# EAGLE design buckconverter (EAGLE 9.6.2)
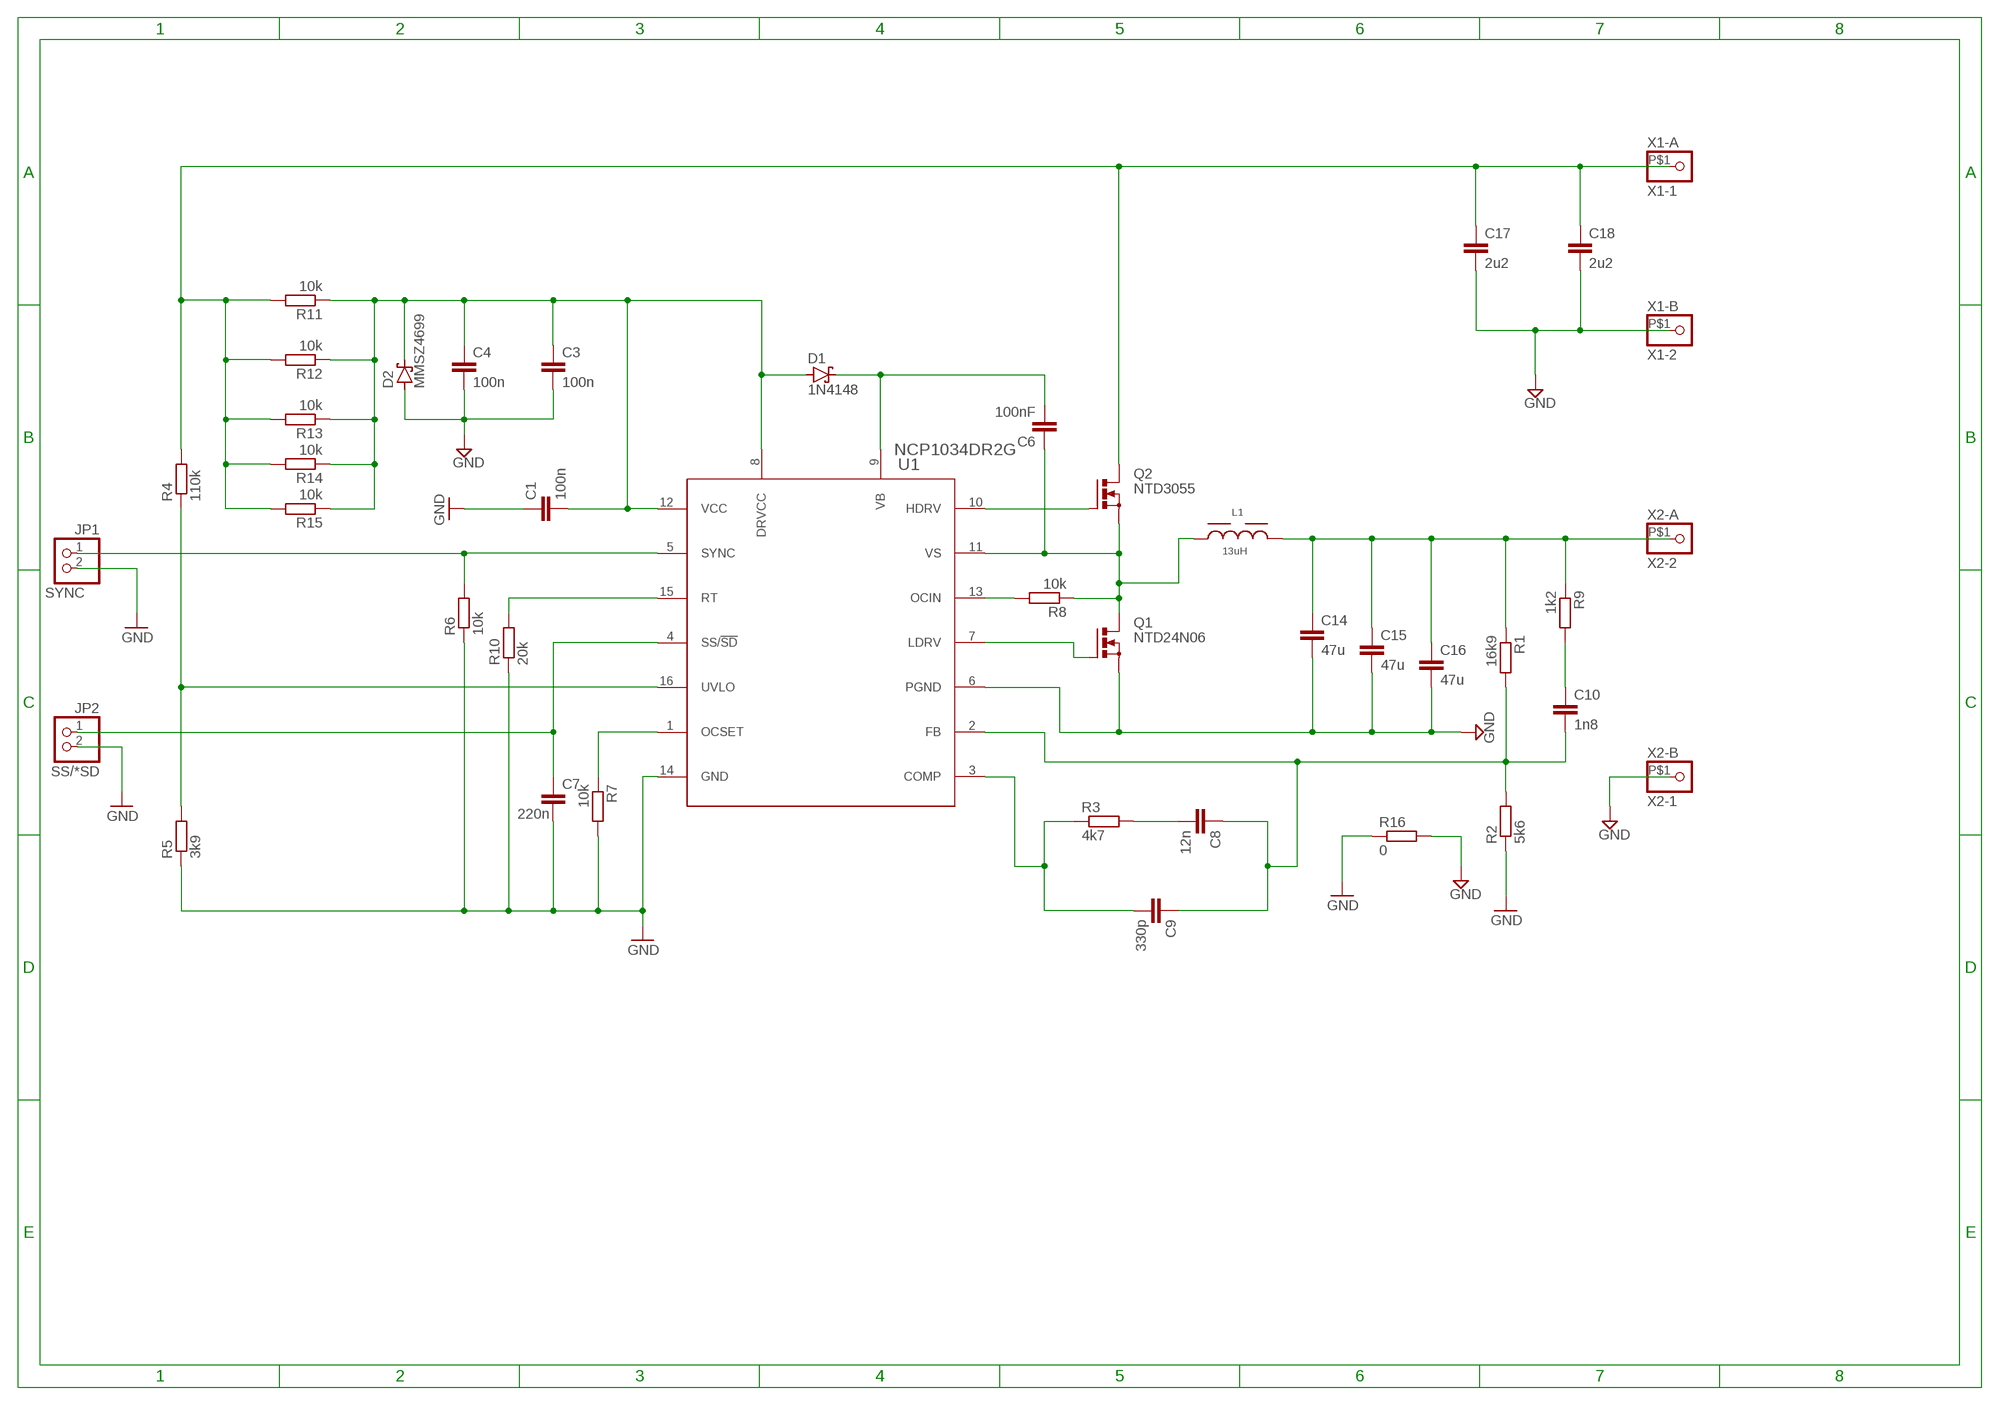
[diagram p0: schematic, sheet 1]

## Parts
C1  100n  C-EUC1206  [C1206]
C3  100n  C-EUC1206  [C1206]
C4  100n  C-EUC1206  [C1206]
C6  100nF  C-EUC1206  [C1206]
C7  220n  C-EUC1206  [C1206]
C8  12n  C-EUC1206  [C1206]
C9  330p  C-EUC1206  [C1206]
C10  1n8  C-EUC1206  [C1206]
C14  47u  C-EUC1210  [C1210]
C15  47u  C-EUC1210  [C1210]
C16  47u  C-EUC1210  [C1210]
C17  2u2  C-EUC1210  [C1210]
C18  2u2  C-EUC1210  [C1210]
D1  1N4148  BAS40  [SOT23]
D2  MMSZ4699  BAS40  [SOT23]
JP1  SYNC  PINHD-1X2  [1X02]
JP2  SS/*SD  PINHD-1X2  [1X02]
L1  13uH  WE-HCI_1365_7443551131  [WE-HCI_1365]
Q1  NTD24N06  PMOSFET_NTO220BV  [TO220BV]
Q2  NTD3055  PMOSFET_NTO220BV  [TO220BV]
R1  16k9  R-EU_R1206  [R1206]
R2  5k6  R-EU_R1206  [R1206]
R3  4k7  R-EU_R1206  [R1206]
R4  110k  R-EU_R1206  [R1206]
R5  3k9  R-EU_R1206  [R1206]
R6  10k  R-EU_R1206  [R1206]
R7  10k  R-EU_R1206  [R1206]
R8  10k  R-EU_R1206  [R1206]
R9  1k2  R-EU_R1206  [R1206]
R10  20k  R-EU_R1206  [R1206]
R11  10k  R-EU_R1206  [R1206]
R12  10k  R-EU_R1206  [R1206]
R13  10k  R-EU_R1206  [R1206]
R14  10k  R-EU_R1206  [R1206]
R15  10k  R-EU_R1206  [R1206]
R16  0  R-EU_R1206  [R1206]
U1  NCP1034DR2G  [SOIC-16_ONS]
X1-A  X1-1  PINHD-1X1-BIGPOGO  [1X1-BIGPOGO]
X1-B  X1-2  PINHD-1X1-BIGPOGO  [1X1-BIGPOGO]
X2-A  X2-2  PINHD-1X1-BIGPOGO  [1X1-BIGPOGO]
X2-B  X2-1  PINHD-1X1-BIGPOGO  [1X1-BIGPOGO]

## Nets
GND: C1.1 C3.2 C4.2 C7.2 C14.2 C15.2 C16.2 C17.2 C18.2 D2.1(A) JP1.2 JP2.2 Q1.S R2.1 R5.1 R6.1 R7.2 R10.1 R16.1 R16.2 U1.6(PGND) U1.14(GND) X1-B.P$1 X2-B.P$1
N$1: R7.1 U1.1(OCSET)
N$2: C7.1 JP2.1 U1.4(SS/!SD)
N$3: R10.2 U1.15(RT)
N$4: JP1.1 R6.2 U1.5(SYNC)
N$6: Q1.G U1.7(LDRV)
N$7: R8.2 U1.13(OCIN)
N$8: C6.1 L1.1 Q1.D Q2.S R8.1 U1.11(VS)
N$9: Q2.G U1.10(HDRV)
N$10: C6.2 D1.3(C) U1.9(VB)
N$11: C10.1 R9.2
N$12: C8.2 R3.2
N$13: C8.1 C9.1 C10.2 R1.2 R2.2 U1.2(FB)
N$14: C14.1 C15.1 C16.1 L1.2 R1.1 R9.1 X2-A.P$1
N$15: C9.2 R3.1 U1.3(COMP)
N$18: C17.1 C18.1 Q2.D R4.2 R11.2 R12.2 R13.2 R14.2 R15.2 X1-A.P$1
N$19: R4.1 R5.2 U1.16(UVLO)
N$21: C1.2 C3.1 C4.1 D1.1(A) D2.3(C) R11.1 R12.1 R13.1 R14.1 R15.1 U1.8(DRVCC) U1.12(VCC)

## Library data of the parts
C1 C3 C4 C6-C10 C14-C18 = rcl:C-EU: CAPACITOR, European symbol; SPICEPREFIX: C
D1 D2 = diode:BAS40: Silicon Schottky Diodes General-purpose diode for high-speed switching
JP1 JP2 = pinhead:PINHD-1X2: PIN HEADER
L1 = Wurth_Power Magnetics_WE-HCI:WE-HCI_1365: WE-HCI SMD Flat Wire High Current Inductor Shielded Characteristics AECQ 200 qualified Magnetically shielded Flat wire coil for low losses at high frequency Low stray field Operating temperature: –40 °C to +125°C / +150 °C / +155°C Recommended solder profile: Reflow Applications Graphic cards Laptops Industrial computers Motherboards High current switching regulators DC/DC converter Polyphase-switching regulators Filter <https://katalog.we-online.de/media/images/v2/o14796v209%20Family_WE-HCI.jpg> Details see: https://katalog.we-online.de/en/pbs/WE-HCI#vs_ct:13 Updated by Yingchun, Shan 2019-08-06 2019 (C) Wurth Elektronik; DATASHEET-URL: https://katalog.we-online.com/pbs/datasheet/7443551131.pdf; FRES: 14MHz; IR: 10A; ISAT: 9A; LR: 9uH; MATERIAL: WE-PERM; PART-NUMBER: 7443551131; RDC: 11.2mOhm
Q1 Q2 = transistor-power:PMOSFET_N: Power MOSFET N-Channel
R1-R16 = rcl:R-EU_: RESISTOR, European symbol; SPICEPREFIX: R
U1 = NCP1034:NCP1034DR2G; COPYRIGHT: Copyright (C) 2022 Ultra Librarian. All rights reserved.; DIGI-KEY_PART_NUMBER_1: NCP1034DR2GOSCT-ND; DIGI-KEY_PART_NUMBER_2: NCP1034DR2GOSDKR-ND; DIGI-KEY_PART_NUMBER_3: NCP1034DR2GOSTR-ND; DIGI-KEY_PART_NUMBER_4: 2156-NCP1034DR2G-OS-ND; MANUFACTURER_PART_NUMBER: NCP1034DR2G; MFR_NAME: onsemi
X1-A X1-B X2-A X2-B = adafruit:PINHD-1X1: Pin header 1x1 for 0.1" spacing With round pins

## Net classes
0 default: width 0.254 mm, drill 0.406 mm, clearance 0.254 mm

## Board
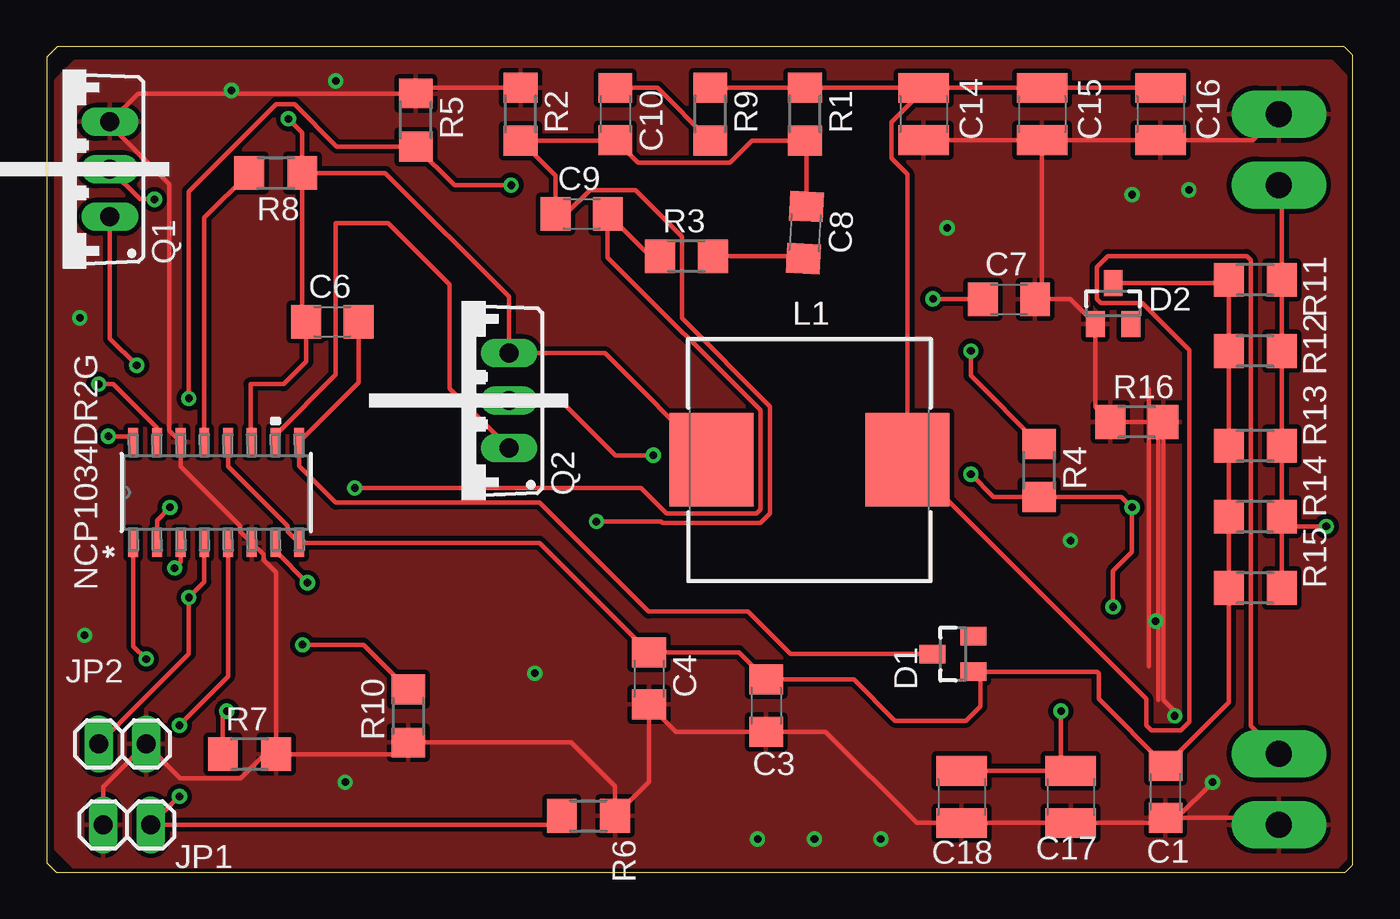
[diagram p1: board, top side]
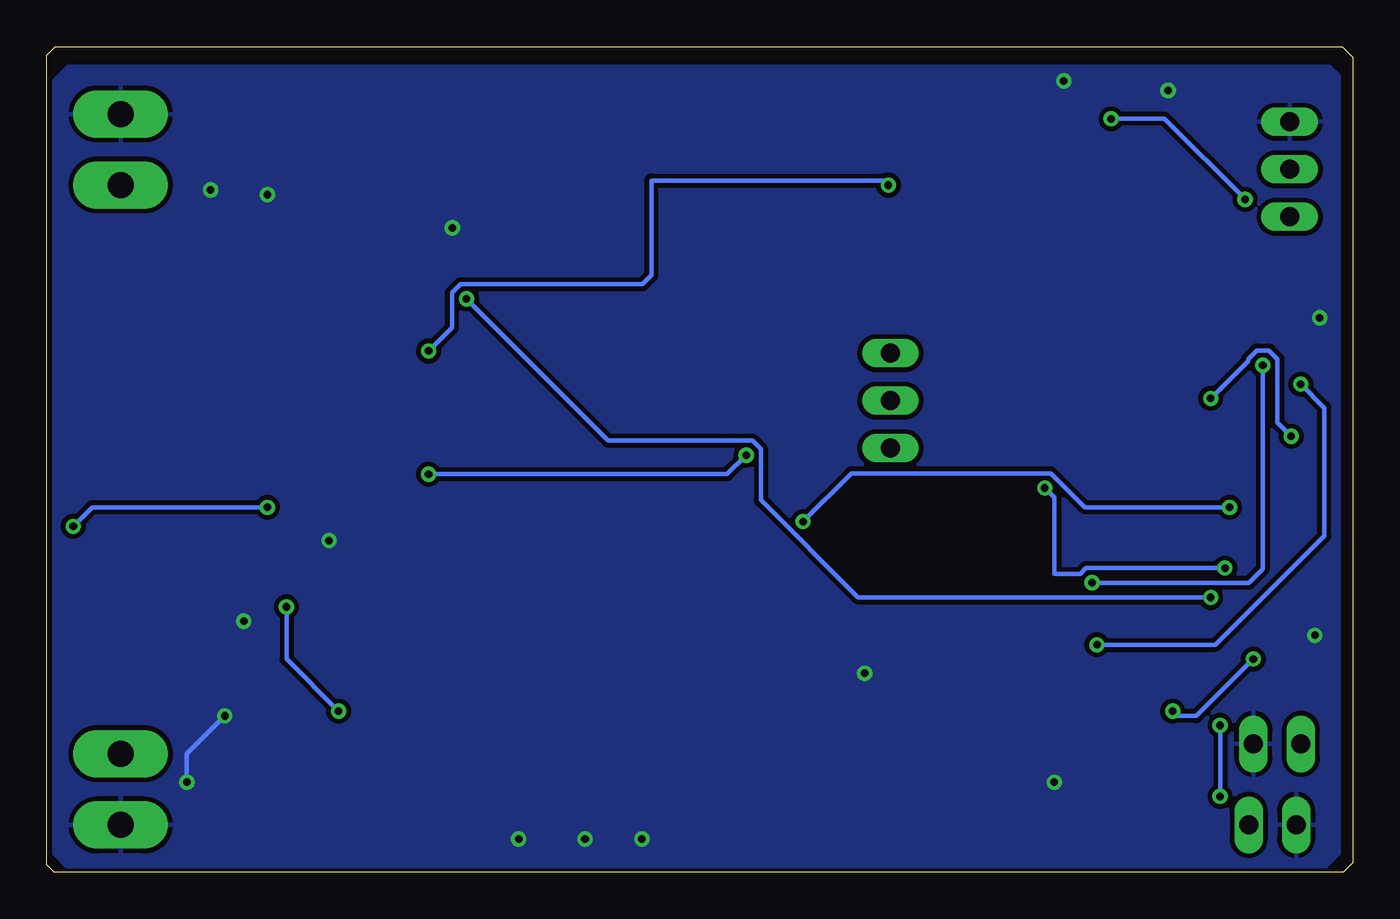
[diagram p2: board, bottom side, seen from below]

Size 70 x 44.25 mm. Coordinates in mm from the lower left corner, seen from the top.
Outline: 69.54,44.25 0.57,44.25 0,43.69 0,0.51 0.51,0 69.6,0 70,0.4 70,43.79 69.54,44.25
Copper layers (1*16): Top 0.035mm / dielectric 1.5mm / Bottom 0.035mm
Design rules "default *": minimum track width 8mil, minimum drill 0.35mm, track to track 8mil, track to pad 8mil, pad to pad 8mil, via to via 8mil, smd to smd 6mil, copper to edge 8mil, drill to drill 6mil, minimum pad ring 10mil, minimum via ring 8mil, stop-mask expansion 4mil, vias tented up to drill 0mil, thermal gap 10mil

### Footprints (pad centres in the part's own frame; a part is rotated, then mirrored left to right if it is on the bottom)
C1206 = smd 1.6 x 1.8: 1 -1.4,0; 2 1.4,0
C1210 = smd 1.6 x 2.7: 1 -1.4,0; 2 1.4,0
SOT23 = smd 1 x 1.4: 1 -0.95,-1.1; 2 0.95,-1.1; 3 0,1.1
1X02 = drill 1.016 long: 1 -1.27,0; 2 1.27,0
WE-HCI_1365 = smd 4.5 x 5: 1 -5.25,0; 2 5.25,0
TO220BV = drill 1.016 long: D 0,-2.54; G -2.54,-2.54; S 2.54,-2.54
R1206 = smd 1.6 x 1.803: 1 -1.422,0; 2 1.422,0
SOIC-16_ONS = smd 1.493 x 0.533: 1 -2.702,4.445; 2 -2.702,3.175; 3 -2.702,1.905; 4 -2.702,0.635; 5 -2.702,-0.635; 6 -2.702,-1.905; 7 -2.702,-3.175; 8 -2.702,-4.445; 9 2.702,-4.445; 10 2.702,-3.175; 11 2.702,-1.905; 12 2.702,-0.635; 13 2.702,0.635; 14 2.702,1.905; 15 2.702,3.175; 16 2.702,4.445
1X1-BIGPOGO = drill 1.4 pad 2.54 long: P$1 0,0

### Placement (x,y rotation side)
C1  59.96,4.31 90 top
C3  38.56,8.93 270 top
C4  32.28,10.39 270 top
C6  15.31,29.51 0 top
C7  51.57,30.71 0 top
C8  40.64,34.29 266.9 top
C9  28.67,35.29 0 top
C10  30.48,40.64 270 top
C14  46.99,40.64 270 top
C15  53.34,40.64 270 top
C16  59.69,40.64 270 top
C17  54.88,4.04 270 top
C18  49.03,4.04 270 top
D1  48.57,11.7 90 top
D2  57.15,30.48 0 top
JP1  4.31,2.54 180 top
JP2  4.06,6.87 0 top
L1  40.88,22.11 0 top
Q1  0.85,37.68 90 top
Q2  22.24,25.28 90 top
R1  40.64,40.64 270 top
R2  25.4,40.64 270 top
R3  34.29,33.02 0 top
R4  53.18,21.54 270 top
R5  19.78,40.32 270 top
R6  29.03,3.02 180 top
R7  10.87,6.33 0 top
R8  12.28,37.48 180 top
R9  35.56,40.64 270 top
R10  19.38,8.37 90 top
R11  64.77,31.75 0 top
R12  64.77,27.94 0 top
R13  64.77,22.86 0 top
R14  64.77,19.05 0 top
R15  64.77,15.24 0 top
R16  58.42,24.13 0 top
U1  9.09,20.36 90 top
X1-A  66.04,36.83 0 top
X1-B  66.04,40.64 0 top
X2-A  66.04,6.35 0 top
X2-B  66.04,2.54 0 top

### Tracks (layer width: path | path; a pad name or v marks a point on that pad's centre or on a via)
GND  (via drill 0.41)
  Top 0.254: X1-B.P$1 64.64,39.24 C16.2 C15.2 | C15.2 C14.2 | C15.2 53.34,31.08 C7.2 54.87,30.71 D2.1 56.2,24.93 R16.1 59.59,24.13 | 59.59,24.13 R16.2 59.84,9.25 60.45,8.64 v60.45,8.38 | R2.1 20.1,42.06 R5.1 4.91,41.74 Q1.S 3.39,40.06 6.56,36.89 6.56,23.68 U1.14 7.18,21.75 10.37,18.56 10.37,18.28 U1.6 11.62,17.04 11.62,16.75 12.29,16.08 R7.2 | JP1.2 3.04,4.59 JP2.2 7.16,5.04 10.4,5.04 11.69,6.33 R7.2 | C1.1 59.69,2.64 C17.2 C18.2 46.64,2.64 41.75,7.53 C3.2 33.74,7.53 C4.2 32.28,4.85 R6.1 30.45,4.6 28.1,6.95 R10.1 18.75,6.33 R7.2 | C1.1 65.67,2.91 X2-B.P$1 | v62.48,4.83 60.57,2.91 C1.1 | 59.59,24.13 59.59,9.25 | 59.08,25.91 59.08,11.02
  Bottom 0.254: v60.45,8.38 62.48,6.35 v62.48,4.83
  other vias: 26.16,10.67 48.26,34.54 1.78,29.72 2.03,12.7 44.7,1.78 41.15,1.78 38.1,1.78 61.21,36.58 54.86,17.78 59.44,13.46 58.17,36.32 15.49,42.42 9.91,41.91 16,4.83
  pour Top: 1.52,43.43 68.83,43.43 69.6,42.67 69.6,0.76 69.09,0.25 68.33,0.25 1.52,0.25 0.51,1.27 0.51,42.42
  pour Bottom: 1.27,43.18 68.83,43.18 69.6,42.42 69.6,1.02 68.83,0.25 1.52,0.25 0.76,1.02 0.76,42.67
N$1  (via drill 0.41)
  Top 0.254: v5.33,11.43 4.64,12.12 U1.1 | v9.65,8.64 9.45,8.43 R7.1
  Bottom 0.254: v5.33,11.43 8.38,8.38 9.65,8.38 v9.65,8.64
N$2  (via drill 0.41)
  Top 0.254: C7.1 47.52,30.71 v47.5,30.73 | U1.4 8.46,15.57 v7.62,14.73 7.62,11.71 JP2.1
  Bottom 0.254: v47.5,30.73 39.9,23.14 32.19,23.14 31.73,22.68 31.73,19.94 26.51,14.73 v7.62,14.73
N$3  (via drill 0.41)
  Top 0.254: R10.2 16.98,12.19 v13.72,12.19 | v2.79,26.16 3.56,26.16 5.92,23.8 U1.15
  Bottom 0.254: v13.72,12.19 7.37,12.19 1.52,18.03 1.52,24.89 v2.79,26.16
N$4  (via drill 0.41)
  Top 0.254: R6.2 27.12,2.54 JP1.1 v7.11,4.06 | U1.5 9.72,10.49 v7.11,7.87
  Bottom 0.254: v7.11,7.87 v7.11,4.06
N$6  (via drill 0.41)
  Top 0.254: Q1.G 3.39,28.61 v4.83,27.18 | v13.97,15.52 12.27,17.22 U1.7
  Bottom 0.254: v4.83,27.18 4.83,16.26 5.56,15.52 v13.97,15.52
N$7
  Top 0.254: R8.2 8.46,35.08 U1.13
N$8  (via drill 0.41)
  Top 0.254: L1.1 29.91,27.82 Q2.S 24.78,30.85 18.15,37.48 R8.1 | Q1.D 5,36.07 v5.78,36.07 | v12.95,40.39 13.7,39.64 R8.1 | R8.1 13.7,29.72 C6.1 13.91,27.37 12.7,26.16 10.92,26.16 10.92,23.14 U1.11
  Bottom 0.254: v5.78,36.07 10.09,40.39 v12.95,40.39
N$9
  Top 0.254: U1.10 12.27,23.44 15.49,26.67 15.49,30.38 15.49,34.8 18.29,34.8 21.59,31.5 21.59,25.93 Q2.G
N$10
  Top 0.254: D1.3 39.86,11.7 37.59,13.97 32.26,13.97 26.42,19.81 15.49,19.81 13.54,21.77 U1.9 16.71,26.24 C6.2
N$11
  Top 0.254: C10.1 32.74,42.04 R9.2
N$12
  Top 0.254: C8.2 40.44,33.02 R3.2
N$13  (via drill 0.41)
  Top 0.254: C8.1 40.72,39.14 R1.2 37.8,39.22 36.62,38.04 31.68,38.04 C10.2 30.46,39.22 R2.2 27.27,37.35 C9.1 27.83,35.29 29.11,36.57 31.56,36.57 34.05,34.08 34.05,29.69 38.77,24.97 38.77,19.24 38.25,18.72 33.01,18.72 32.93,18.8 v29.46,18.8 | v6.6,19.56 5.92,18.87 U1.2
  Bottom 0.254: v6.6,19.56 14.36,19.56 16.18,21.39 26.87,21.39 v29.46,18.8
N$14
  Top 0.254: C16.1 C15.1 C14.1 | C14.1 40.66,42.04 R1.1 R9.1 | C14.1 46.99,41.93 45.26,40.2 45.26,38.28 46.13,37.41 L1.2 58.93,9.31 58.93,7.87 59.21,7.59 60.78,7.59 61.24,8.06 61.24,27.98 58.72,30.5 56.49,30.5 56.27,30.72 56.27,32.44 56.86,33.03 64.31,33.03 64.53,32.81 64.53,7.86 X2-A.P$1
N$15  (via drill 0.41)
  Top 0.254: R3.1 32.34,33.02 C9.2 30.07,32.95 38.26,24.76 38.26,19.45 38.04,19.23 33.22,19.23 31.85,20.6 v16.51,20.6 | v6.86,16.31 7.18,16.63 U1.3
  Bottom 0.254: v16.51,20.6 16,20.09 16,16 14.6,16 14.3,16.31 v6.86,16.31
N$18  (via drill 0.41)
  Top 0.254: C18.1 C17.1 54.36,5.96 v54.36,8.64 | X1-A.P$1 66.19,36.68 R11.2 R12.2 R13.2 R14.2 | R14.2 R15.2 | v68.58,18.54 66.7,18.54 R14.2 | v57.15,14.22 57.15,16.15 58.17,17.16 v58.17,19.56 57.61,20.12 R4.2 50.75,20.12 v49.53,21.34 | v32.51,22.35 30.48,22.35 27.55,25.28 Q2.D
  Bottom 0.254: v68.58,18.54 67.56,19.56 v58.17,19.56 | v57.15,14.22 57.15,11.43 v54.36,8.64 | v49.53,21.34 33.53,21.34 v32.51,22.35
N$19  (via drill 0.41)
  Top 0.254: R4.1 49.53,26.61 v49.53,27.94 | v24.89,36.83 21.85,36.83 R5.2 15.55,38.9 13.28,41.17 12.31,41.17 7.62,36.48 v7.62,25.4 | v3.3,23.37 4.34,23.37 U1.16
  Bottom 0.254: v49.53,27.94 48.28,29.18 48.28,31.06 47.82,31.52 38.08,31.52 37.59,32 37.59,37.08 25.15,37.08 v24.89,36.83 | v7.62,25.4 5.61,27.41 5.61,27.5 5.15,27.96 4.5,27.96 4.04,27.5 4.04,24.11 v3.3,23.37
N$21
  Top 0.254: D2.3 63.18,31.58 R11.1 R12.1 R13.1 R14.1 R15.1 63.35,9.1 C1.2 56.39,9.28 56.39,10.67 56.31,10.75 D1.1 50.04,10.38 50.04,8.89 49.28,8.13 45.47,8.13 43.26,10.33 C3.1 37.1,11.79 C4.1 26.41,17.66 U1.8 12.91,18.28 12.91,18.56 9.72,21.75 U1.12

### Text on the board
_tplace: *